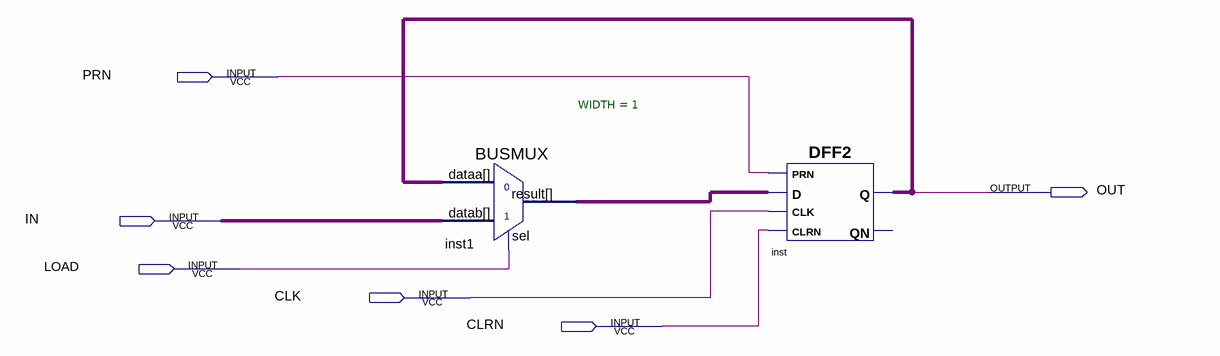
[diagram p0: schematic sheet]
// Quartus schematic register.bdf as structural Verilog: 2 symbols, 6 pins
module register (
  input  PRN,
  input  IN,
  input  LOAD,
  input  CLK,
  input  CLRN,
  output OUT
);

  wire inst1_result, inst_q;

  BUSMUX #(.WIDTH(1)) inst1 (.datab(IN), .sel(LOAD), .dataa(inst_q), .result(inst1_result));
  DFF2 inst (.CLK(CLK), .D(inst1_result), .PRN(PRN), .CLRN(CLRN), .Q(inst_q));  // open: QN
endmodule
